# Altium project BQ76930.PrjPcb
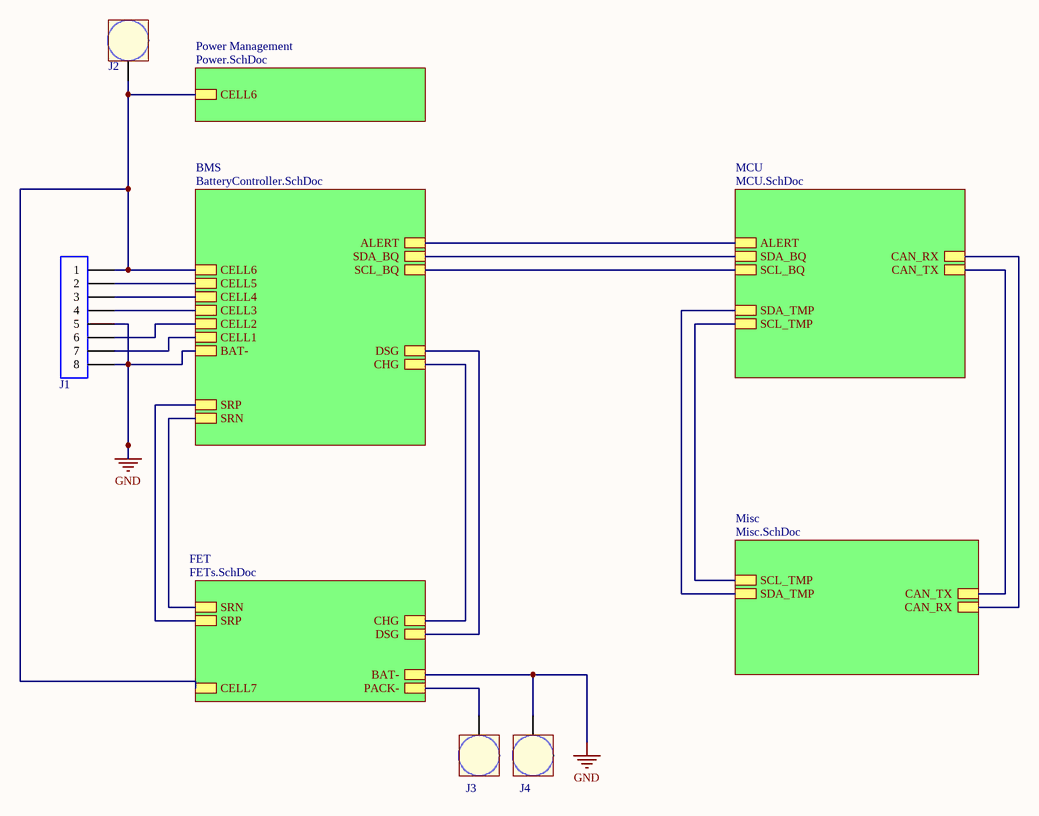
[diagram p0: TopLevel.SchDoc]
6 sheets, 119 parts. Net scope: hierarchical (ports join the sheet entries above them; power ports are global).
Board file: BQ76930.PcbDoc
Sheets:
  TopLevel.SchDoc
    BMS = BatteryController.SchDoc
    MCU = MCU.SchDoc
    FET = FETs.SchDoc
    Misc = Misc.SchDoc
    Power Management = Power.SchDoc

## Sheet TopLevel.SchDoc: TopLevel
size A4; ApprovedBy: Self; CheckedBy: Self; CompanyName: TAISAT; DrawnBy: Alperen FENERCİ; Organization: IKA; SheetNumber: 1; SheetTotal: 6

### Parts
J1  HEADER-MALE-SMT-90C-4COL-2ROW  [0430450810]  (value not drawn)
J2  7460305  [7460305]  (value not drawn)
J3  7460305  [7460305]  (value not drawn)
J4  7460305  [7460305]  (value not drawn)

### Sub-sheets
BMS = BatteryController.SchDoc: CELL1, BAT-, CELL2, CELL3, CELL4, CELL5, CELL6, SCL_BQ, SDA_BQ, CHG, DSG, ALERT, SRN, SRP
FET = FETs.SchDoc: CHG, DSG, PACK-, BAT-, SRN, SRP, CELL7
MCU = MCU.SchDoc: SCL_BQ, SDA_BQ, ALERT, SCL_TMP, SDA_TMP, CAN_RX, CAN_TX
Misc = Misc.SchDoc: CAN_RX, CAN_TX, SCL_TMP, SDA_TMP
Power Management = Power.SchDoc: CELL6

### Nets
GND: J1.5 J1.8 J4.1 ; sheet BMS/BAT-, sheet FET/BAT-
NetC11_1: sheet BMS/ALERT, sheet MCU/ALERT
NetC19_1: sheet BMS/SRP, sheet FET/SRP
NetC20_2: sheet BMS/SRN, sheet FET/SRN
NetC30_1: J1.1 J2.1 ; sheet BMS/CELL6, sheet FET/CELL7, sheet Power Management/CELL6
NetD1_2: J1.3 ; sheet BMS/CELL4
NetD2_2: J1.4 ; sheet BMS/CELL3
NetD3_2: J1.6 ; sheet BMS/CELL2
NetD4_2: J1.7 ; sheet BMS/CELL1
NetD10_2: J1.2 ; sheet BMS/CELL5
NetD18_2: J3.1 ; sheet FET/PACK-
NetQ10_2: sheet BMS/CHG, sheet FET/CHG
NetR29_2: sheet BMS/DSG, sheet FET/DSG
NetR35_1: sheet BMS/SDA_BQ, sheet MCU/SDA_BQ, sheet MCU/SDA_TMP, sheet Misc/SDA_TMP
NetR36_1: sheet BMS/SCL_BQ, sheet MCU/SCL_BQ, sheet MCU/SCL_TMP, sheet Misc/SCL_TMP
NetU2_32: sheet MCU/CAN_RX, sheet Misc/CAN_RX
NetU2_33: sheet MCU/CAN_TX, sheet Misc/CAN_TX

### Notes on the sheet
- Dosya Adı / File Name
- Proje Adı / Project Name
- Sayfa Adı / Sheet Name
- Şirket Adı / Company Name
- Tasarlayan / Designed By
- Takım / Team
- Kontrol Eden / Checked By
- Başlangıç Tarihi / Start Date
- Revize Tarihi / Revision Date
- Onaylayan / Approved By
- Sayfa / Sheet

### Library data of the parts
J1 = 0430450810: Connector; Pin Rows: 2; Pin Positions: 8; Contact Type: Male; ComponentLink1Description: Digikey; ComponentLink1URL: https://www.digikey.com/en/products/detail/molex/0430450810/2404815?s=N4IgTCBcDaIAwBYDMiCscAcBGOIC6AvkA; ComponentLink2Description: Ozdisan; ComponentLink2URL: https://ozdisan.com/connectors-and-interconnects/rectangular-connectors/pcb-connectors/L-KLS1-XM1-3-00-2X04-RT/512932; ComponentLink3Description: Datasheet; ComponentLink3URL: https://www.molex.com/en-us/products/part-detail/430450810?display=pdf; Case/Package: SMD; ComponentLink4Description: Datasheet; ComponentLink4URL: https://cdn.ozdisan.com/ETicaret_Dosya/482201_886496495..pdf
J2-J4 = 7460305: Connector

## Sheet BatteryController.SchDoc: Battery Management
size A3; ApprovedBy: Self; CheckedBy: Self; CompanyName: TAISAT; DrawnBy: Alperen FENERCİ; Organization: IKA; SheetNumber: 2; SheetTotal: 6
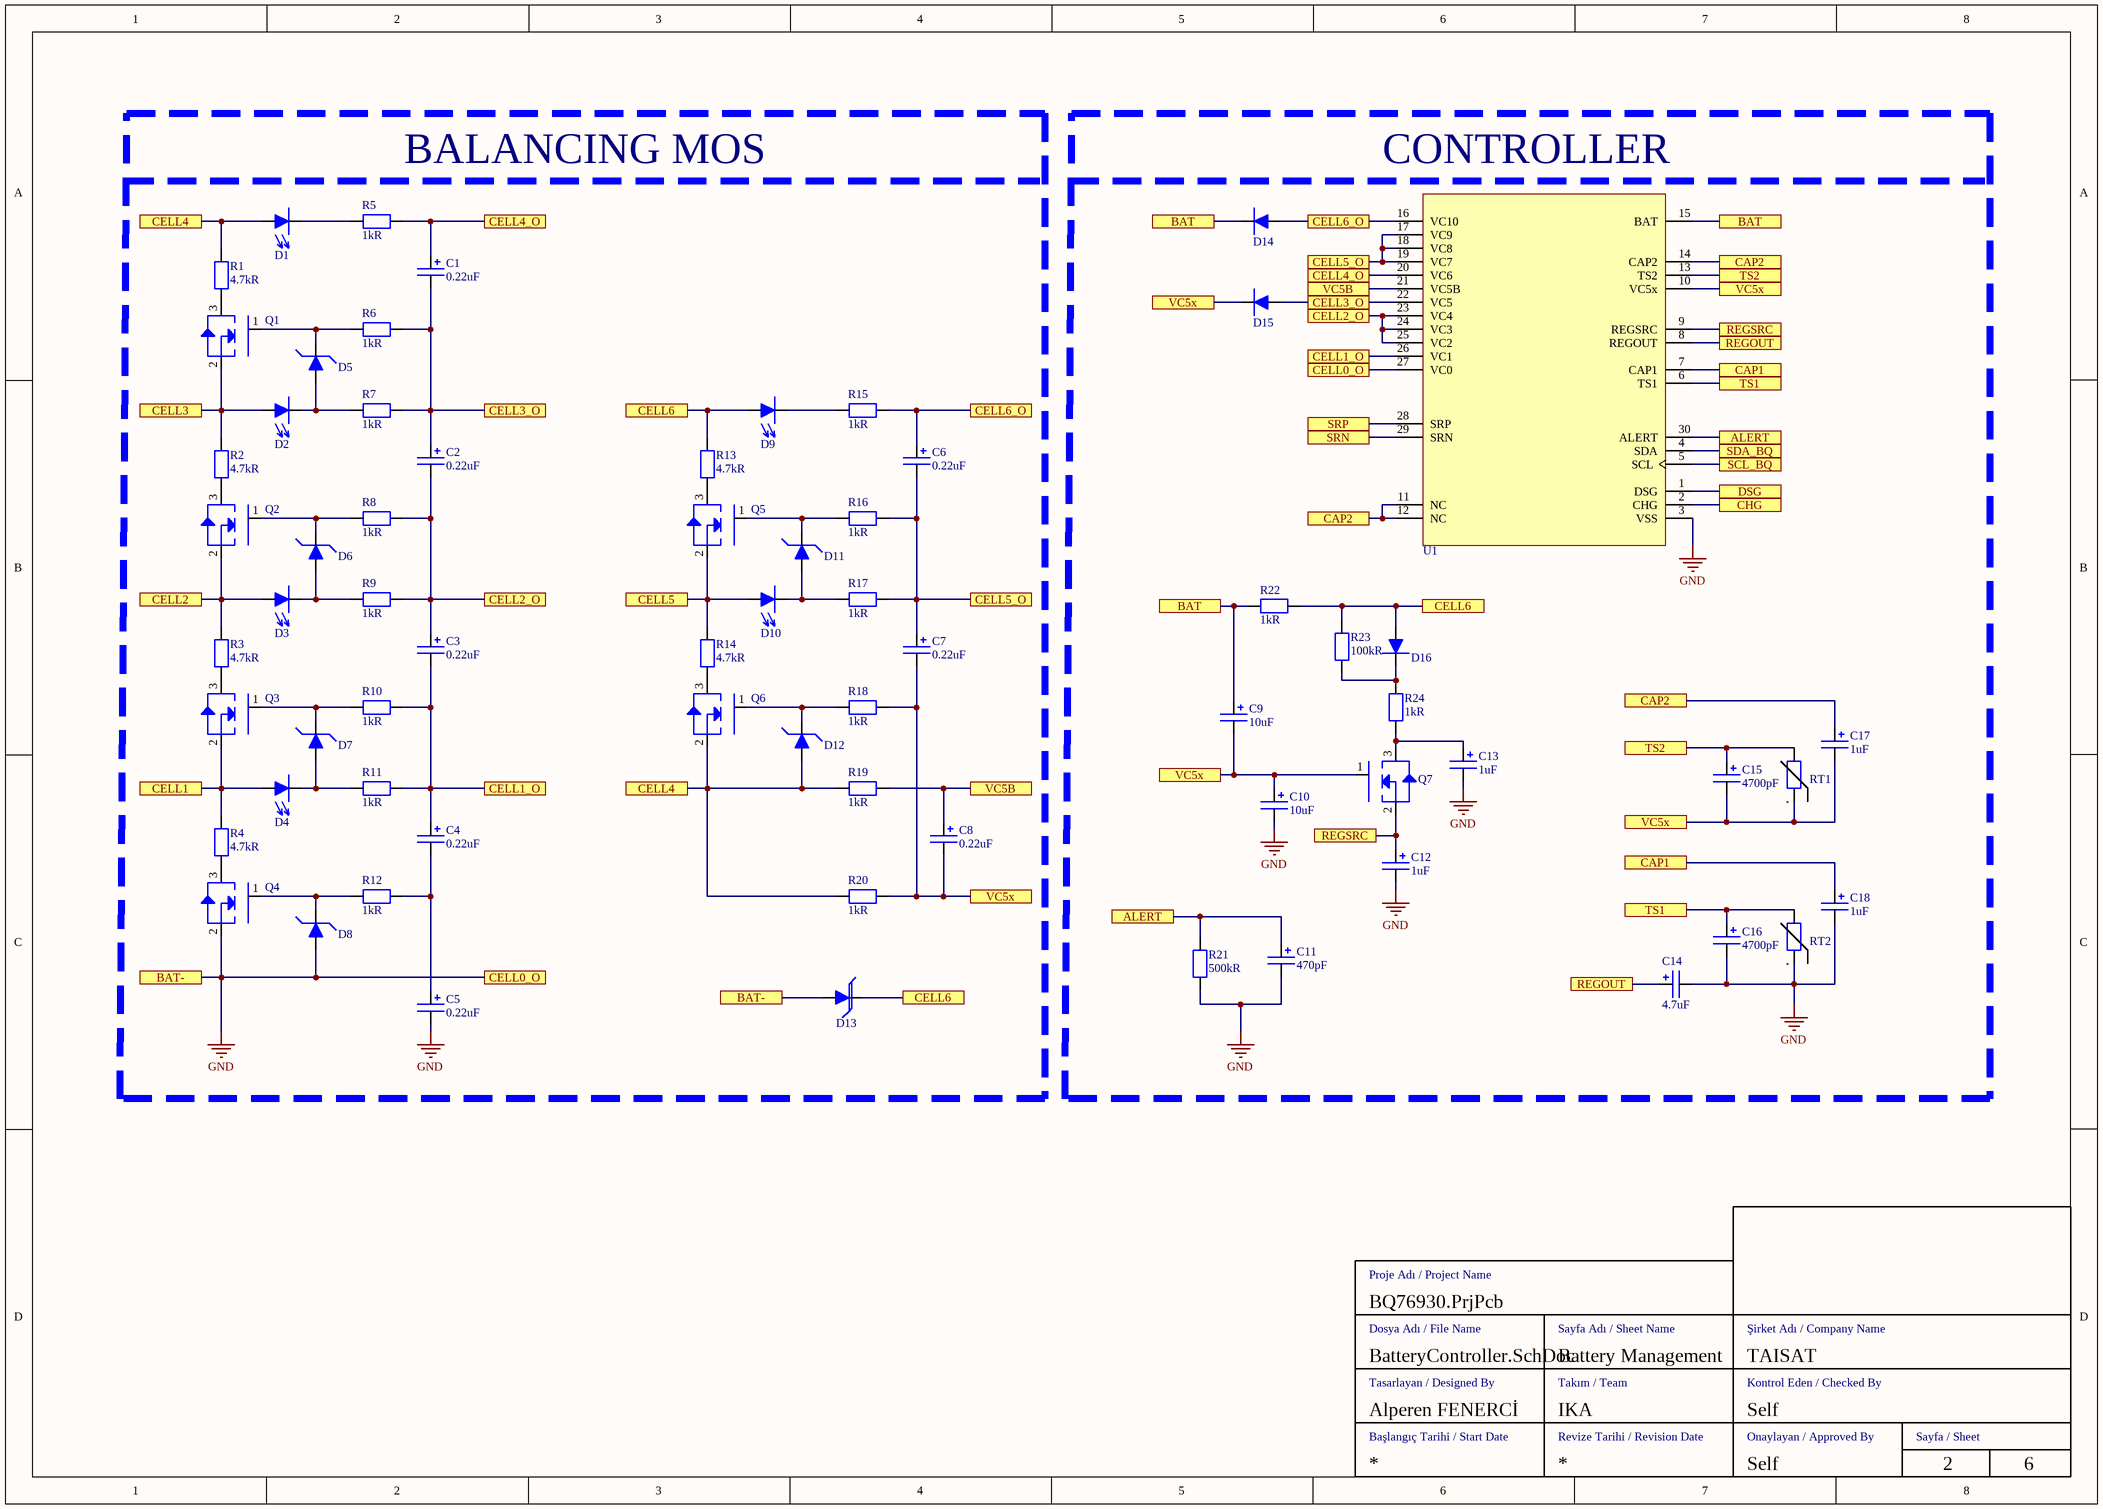
[diagram p1: BatteryController.SchDoc]

### Parts
C1  value 0.22uF  [CAP 0603]  (hidden comment: CAP 0603)
C2  value 0.22uF  [CAP 0603]  (hidden comment: CAP 0603)
C3  value 0.22uF  [CAP 0603]  (hidden comment: CAP 0603)
C4  value 0.22uF  [CAP 0603]  (hidden comment: CAP 0603)
C5  value 0.22uF  [CAP 0603]  (hidden comment: CAP 0603)
C6  value 0.22uF  [CAP 0603]  (hidden comment: CAP 0603)
C7  value 0.22uF  [CAP 0603]  (hidden comment: CAP 0603)
C8  value 0.22uF  [CAP 0603]  (hidden comment: CAP 0603)
C9  value 10uF  [CAP 0603]  (hidden comment: CAP 0603)
C10  value 10uF  [CAP 0603]  (hidden comment: CAP 0603)
C11  value 470pF  [CAP 0603]  (hidden comment: CAP 0603)
C12  value 1uF  [CAP 0603]  (hidden comment: CAP 0603)
C13  value 1uF  [CAP 0603]  (hidden comment: CAP 0603)
C14  value 4.7uF  [CAP 0603]  (hidden comment: CAP 0603)
C15  value 4700pF  [CAP 0603]  (hidden comment: CAP 0603)
C16  value 4700pF  [CAP 0603]  (hidden comment: CAP 0603)
C17  value 1uF  [CAP 0603]  (hidden comment: CAP 0603)
C18  value 1uF  [CAP 0603]  (hidden comment: CAP 0603)
D1  LTW-C191TLA  [LED 0603]  (value not drawn)
D2  LTW-C191TLA  [LED 0603]  (value not drawn)
D3  LTW-C191TLA  [LED 0603]  (value not drawn)
D4  LTW-C191TLA  [LED 0603]  (value not drawn)
D5  MM3Z5V1T1G  [SOD323]  (value not drawn)
D6  MM3Z5V1T1G  [SOD323]  (value not drawn)
D7  MM3Z5V1T1G  [SOD323]  (value not drawn)
D8  MM3Z5V1T1G  [SOD323]  (value not drawn)
D9  LTW-C191TLA  [LED 0603]  (value not drawn)
D10  LTW-C191TLA  [LED 0603]  (value not drawn)
D11  MM3Z5V1T1G  [SOD323]  (value not drawn)
D12  MM3Z5V1T1G  [SOD323]  (value not drawn)
D13  SMAJ36A-HT  [DO214AC]  (value not drawn)
D14  BAV20W-7-F  [SOD123]  (value not drawn)
D15  BAV20W-7-F  [SOD123]  (value not drawn)
D16  1N4148WS  [SOD323]  (value not drawn)
Q1  2N7002K  [SOT23-3]  (value not drawn)
Q2  2N7002K  [SOT23-3]  (value not drawn)
Q3  2N7002K  [SOT23-3]  (value not drawn)
Q4  2N7002K  [SOT23-3]  (value not drawn)
Q5  2N7002K  [SOT23-3]  (value not drawn)
Q6  2N7002K  [SOT23-3]  (value not drawn)
Q7  2N7002K  [SOT23-3]  (value not drawn)
R1  value 4.7kR  [RESISTOR 1206]  (hidden comment: RES 1206)
R2  value 4.7kR  [RESISTOR 1206]  (hidden comment: RES 1206)
R3  value 4.7kR  [RESISTOR 1206]  (hidden comment: RES 1206)
R4  value 4.7kR  [RESISTOR 1206]  (hidden comment: RES 1206)
R5  value 1kR  [RESISTOR 0603]  (hidden comment: RES 0603)
R6  value 1kR  [RESISTOR 0603]  (hidden comment: RES 0603)
R7  value 1kR  [RESISTOR 0603]  (hidden comment: RES 0603)
R8  value 1kR  [RESISTOR 0603]  (hidden comment: RES 0603)
R9  value 1kR  [RESISTOR 0603]  (hidden comment: RES 0603)
R10  value 1kR  [RESISTOR 0603]  (hidden comment: RES 0603)
R11  value 1kR  [RESISTOR 0603]  (hidden comment: RES 0603)
R12  value 1kR  [RESISTOR 0603]  (hidden comment: RES 0603)
R13  value 4.7kR  [RESISTOR 1206]  (hidden comment: RES 1206)
R14  value 4.7kR  [RESISTOR 1206]  (hidden comment: RES 1206)
R15  value 1kR  [RESISTOR 0603]  (hidden comment: RES 0603)
R16  value 1kR  [RESISTOR 0603]  (hidden comment: RES 0603)
R17  value 1kR  [RESISTOR 0603]  (hidden comment: RES 0603)
R18  value 1kR  [RESISTOR 0603]  (hidden comment: RES 0603)
R19  value 1kR  [RESISTOR 0603]  (hidden comment: RES 0603)
R20  value 1kR  [RESISTOR 0603]  (hidden comment: RES 0603)
R21  value 500kR  [RESISTOR 0603]  (hidden comment: RES 0603)
R22  value 1kR  [RESISTOR 0603]  (hidden comment: RES 0603)
R23  value 100kR  [RESISTOR 0603]  (hidden comment: RES 0603)
R24  value 1kR  [RESISTOR 0603]  (hidden comment: RES 0603)
RT1  NTC 0603  [NTC 0603]  (value not drawn)
RT2  NTC 0603  [NTC 0603]  (value not drawn)
U1  BQ76930  [TSSOP-30]  (value not drawn)

### Blocks framed on the sheet
BALANCING MOS: C1-C8 D1-D13 Q1-Q6 R1-R20
CONTROLLER: C9-C18 D14-D16 Q7 R21-R24 RT1 RT2 U1

### Ports
ALERT, BAT, BAT-, CAP1, CAP2, CELL0_O, CELL1, CELL1_O, CELL2, CELL2_O, CELL3, CELL3_O, CELL4, CELL4_O, CELL5, CELL5_O, CELL6, CELL6_O, CHG, DSG, REGOUT, REGSRC, SCL_BQ, SDA_BQ, SRN, SRP, TS1, TS2, VC5B, VC5x

### Nets
GND: C5.2 C10.2 C11.2 C12.2 C13.2 C14.2 C16.2 C18.2 D8.2 D13.2 Q4.2(S) R21.1 RT2.1 U1.3(VSS) U1.27(VC0) ; port BAT-, port CELL0_O
NetC1_1: C1.1 R5.1 U1.20(VC6) ; port CELL4_O
NetC1_2: C1.2 C2.1 D15.2 R6.1 R7.1 U1.22(VC5) ; port CELL3_O
NetC2_2: C2.2 C3.1 R8.1 R9.1 U1.23(VC4) U1.24(VC3) U1.25(VC2) ; port CELL2_O
NetC3_2: C3.2 C4.1 R10.1 R11.1 U1.26(VC1) ; port CELL1_O
NetC4_2: C4.2 C5.1 R12.1
NetC6_1: C6.1 D14.2 R15.1 U1.16(VC10) ; port CELL6_O
NetC6_2: C6.2 C7.1 R16.1 R17.1 U1.17(VC9) U1.18(VC8) U1.19(VC7) ; port CELL5_O
NetC7_2: C7.2 C8.2 C9.2 C10.1 C15.2 C17.2 D15.1 Q7.1(G) R18.1 R20.1 RT1.1 U1.10(VC5x) ; port VC5x
NetC8_1: C8.1 R19.1 U1.21(VC5B) ; port VC5B
NetC9_1: C9.1 D14.1 R22.2 U1.15(BAT) ; port BAT
NetC11_1: C11.1 R21.2 U1.30(ALERT) ; port ALERT
NetC12_1: C12.1 Q7.2(S) U1.9(REGSRC) ; port REGSRC
NetC13_1: C13.1 Q7.3(D) R24.1
NetC14_1: C14.1 U1.8(REGOUT) ; port REGOUT
NetC15_1: C15.1 RT1.2 U1.13(TS2) ; port TS2
NetC16_1: C16.1 RT2.2 U1.6(TS1) ; port TS1
NetC17_1: C17.1 U1.11(NC) U1.12(NC) U1.14(CAP2) ; port CAP2
NetC18_1: C18.1 U1.7(CAP1) ; port CAP1
NetC19_1: U1.28(SRP) ; port SRP
NetC20_2: U1.29(SRN) ; port SRN
NetC30_1: D9.2 D13.1 D16.2 R13.2 R22.1 R23.2 ; port CELL6
NetD1_1: D1.1 R5.2
NetD1_2: D1.2 D12.2 Q6.2(S) R1.2 R19.2 R20.2 ; port CELL4
NetD2_1: D2.1 D5.2 R7.2
NetD2_2: D2.2 Q1.2(S) R2.2 ; port CELL3
NetD3_1: D3.1 D6.2 R9.2
NetD3_2: D3.2 Q2.2(S) R3.2 ; port CELL2
NetD4_1: D4.1 D7.2 R11.2
NetD4_2: D4.2 Q3.2(S) R4.2 ; port CELL1
NetD5_1: D5.1 Q1.1(G) R6.2
NetD6_1: D6.1 Q2.1(G) R8.2
NetD7_1: D7.1 Q3.1(G) R10.2
NetD8_1: D8.1 Q4.1(G) R12.2
NetD9_1: D9.1 R15.2
NetD10_1: D10.1 D11.2 R17.2
NetD10_2: D10.2 Q5.2(S) R14.2 ; port CELL5
NetD11_1: D11.1 Q5.1(G) R16.2
NetD12_1: D12.1 Q6.1(G) R18.2
NetD16_1: D16.1 R23.1 R24.2
NetQ1_3: Q1.3(D) R1.1
NetQ2_3: Q2.3(D) R2.1
NetQ3_3: Q3.3(D) R3.1
NetQ4_3: Q4.3(D) R4.1
NetQ5_3: Q5.3(D) R13.1
NetQ6_3: Q6.3(D) R14.1
NetQ10_2: U1.2(CHG) ; port CHG
NetR29_2: U1.1(DSG) ; port DSG
NetR35_1: U1.4(SDA) ; port SDA_BQ
NetR36_1: U1.5(SCL) ; port SCL_BQ

### Notes on the sheet
- Dosya Adı / File Name
- Proje Adı / Project Name
- Sayfa Adı / Sheet Name
- Şirket Adı / Company Name
- Tasarlayan / Designed By
- Takım / Team
- Kontrol Eden / Checked By
- Başlangıç Tarihi / Start Date
- Revize Tarihi / Revision Date
- Onaylayan / Approved By
- Sayfa / Sheet

### Library data of the parts
C1-C18 = CAP 0603: Multilayer Ceramic Capacitor; Capacitor Type: MLCC; Case/Package: 0603
D1-D4 D9 D10 = LED 0603: Chip LED; Case/Package: 0603
D5-D8 D11 D12 = MM3Z5V1T1G: Diode Zener; Voltage: 5.1V; Case/Package: SOD323; Diode Type: Zener; ComponentLink1Description: Ozdisan; ComponentLink1URL: https://ozdisan.com/power-semiconductors/diodes-diode-modules-and-rectifiers/zener-diodes/MM3Z5V1T1G/611730
D13 = SMAJ36A-HT: Diode TVS; Voltage: 36V; Diode Type: TVS; Case/Package: DO214
D14 D15 = BAV20W-7-F: Diode Switch; Voltage: 150V; Case/Package: SOD123; Diode Type: Switch
D16 = 1N4148WS: Diode Gen; Voltage: 75V; Diode Type: General; Case/Package: DO-41-2; ComponentLink1Description: Ozdisan; ComponentLink1URL: https://ozdisan.com/power-semiconductors/diodes-diode-modules-and-rectifiers/general-purpose-diodes/1N4148WS-HT/453557
Q1-Q7 = 2N7002K: MOSFET; Voltage: 60V; Current: 300mA; Transistor Type: N-CH; Case/Package: SOT23
R1-R4 R13 R14 = RES 1206: SMD Chip Resistor; Case/Package: 1206
R5-R12 R15-R24 = RES 0603: SMD Chip Resistor; Case/Package: 0603
RT1 RT2 = NTC 0603: Thermistor NTC; Value: 10kR; Case/Package: 0603
U1 = BQ76930: Cell Balance, Cell Monitoring; Category: PMIC; Case/Package: TSSOP

## Sheet MCU.SchDoc: Controller
size A4; ApprovedBy: Self; CheckedBy: Self; CompanyName: TAISAT; DrawnBy: Alperen FENERCİ; Organization: IKA; SheetNumber: 4; SheetTotal: 6
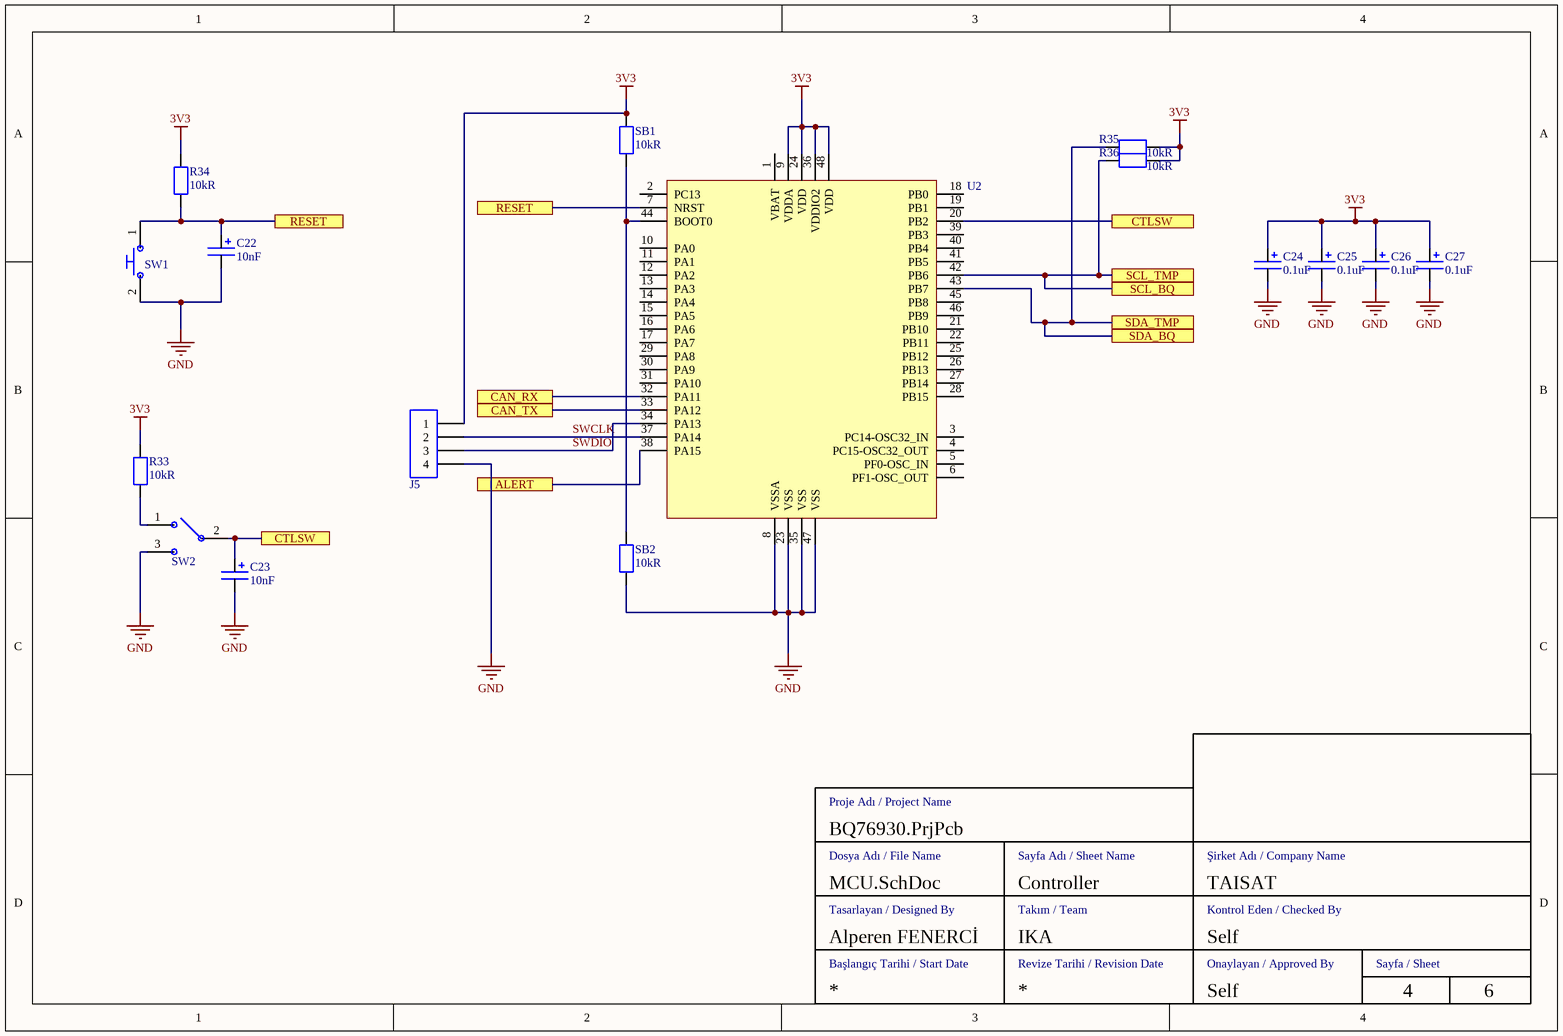
[diagram p2: MCU.SchDoc]

### Parts
C22  value 10nF  [CAP 0603]  (hidden comment: CAP 0603)
C23  value 10nF  [CAP 0603]  (hidden comment: CAP 0603)
C24  value 0.1uF  [CAP 0603]  (hidden comment: CAP 0603)
C25  value 0.1uF  [CAP 0603]  (hidden comment: CAP 0603)
C26  value 0.1uF  [CAP 0603]  (hidden comment: CAP 0603)
C27  value 0.1uF  [CAP 0603]  (hidden comment: CAP 0603)
J5  146285-4  [HMATHT00C41]  (value not drawn)
R33  value 10kR  [RESISTOR 0603]  (hidden comment: RES 0603)
R34  value 10kR  [RESISTOR 0603]  (hidden comment: RES 0603)
R35  value 10kR  [RESISTOR 0603]  (hidden comment: RES 0603)
R36  value 10kR  [RESISTOR 0603]  (hidden comment: RES 0603)
SB1  value 10kR  [RESISTOR 0603]  (hidden comment: RES 0603)
SB2  value 10kR  [RESISTOR 0603]  (hidden comment: RES 0603)
SW1  DS1042-03  [SWITCH-6X6]  (value not drawn)
SW2  L-KLS7-SS-12F20A  [SPDT]  (value not drawn)
U2  STM32F072C8  [LQFP48]  (value not drawn)

### Ports
ALERT, CAN_RX, CAN_TX, CTLSW, RESET, SCL_BQ, SCL_TMP, SDA_BQ, SDA_TMP

### Nets
3V3: C24.1 C25.1 C26.1 C27.1 J5.1 R33.2 R34.2 R35.2 R36.2 SB1.2 U2.9(VDDA) U2.24(VDD) U2.36(VDDIO2) U2.48(VDD)
GND: C22.2 C23.2 C24.2 C25.2 C26.2 C27.2 J5.4 SB2.1 SW1.2 SW2.3 U2.8(VSSA) U2.23(VSS) U2.35(VSS) U2.47(VSS)
SWCLK: J5.2 U2.37(PA14)
SWDIO: J5.3 U2.34(PA13)
NetC11_1: U2.38(PA15) ; port ALERT
NetC22_1: C22.1 R34.1 SW1.1 U2.7(NRST) ; port RESET
NetC23_1: C23.1 SW2.2 U2.20(PB2) ; port CTLSW
NetR33_1: R33.1 SW2.1
NetR35_1: R35.1 U2.43(PB7) ; port SDA_BQ, port SDA_TMP
NetR36_1: R36.1 U2.42(PB6) ; port SCL_BQ, port SCL_TMP
NetSB1_1: SB1.1 SB2.2 U2.44(BOOT0)
NetU2_32: U2.32(PA11) ; port CAN_RX
NetU2_33: U2.33(PA12) ; port CAN_TX

Not connected (* = marked no-connect by the designer): U2 1(VBAT) 2(PC13) 3(PC14-OSC32_IN) 4(PC15-OSC32_OUT) 5(PF0-OSC_IN) 6(PF1-OSC_OUT) 10(PA0) 11(PA1) 12(PA2) 13(PA3) 14(PA4) 15(PA5) 16(PA6) 17(PA7) 18(PB0) 19(PB1) 21(PB10) 22(PB11) 25(PB12) 26(PB13) 27(PB14) 28(PB15) 29(PA8) 30(PA9) 31(PA10) 39(PB3) 40(PB4) 41(PB5) 45(PB8) 46(PB9)

### Notes on the sheet
- Dosya Adı / File Name
- Proje Adı / Project Name
- Sayfa Adı / Sheet Name
- Şirket Adı / Company Name
- Tasarlayan / Designed By
- Takım / Team
- Kontrol Eden / Checked By
- Başlangıç Tarihi / Start Date
- Revize Tarihi / Revision Date
- Onaylayan / Approved By
- Sayfa / Sheet

### Library data of the parts
C22-C27 = CAP 0603: as C1 on sheet BatteryController; Case/Package: 0603
J5 = HMATHT00C41: Header for PCB
R33-R36 SB1 SB2 = RES 0603: SMD Chip Resistor; Case/Package: 0603
SW1 = DS1042-03: Switch
SW2 = L-KLS7-SS-12F20A: Switch
U2 = STM32F072C8: STM32 ARM Cortex M0; Case/Package: LQFP; Pins: 48; Category: MCU

## Sheet FETs.SchDoc: FET System
size A4; ApprovedBy: Self; CheckedBy: Self; CompanyName: TAISAT; DrawnBy: Alperen FENERCİ; Organization: IKA; SheetNumber: 3; SheetTotal: 6
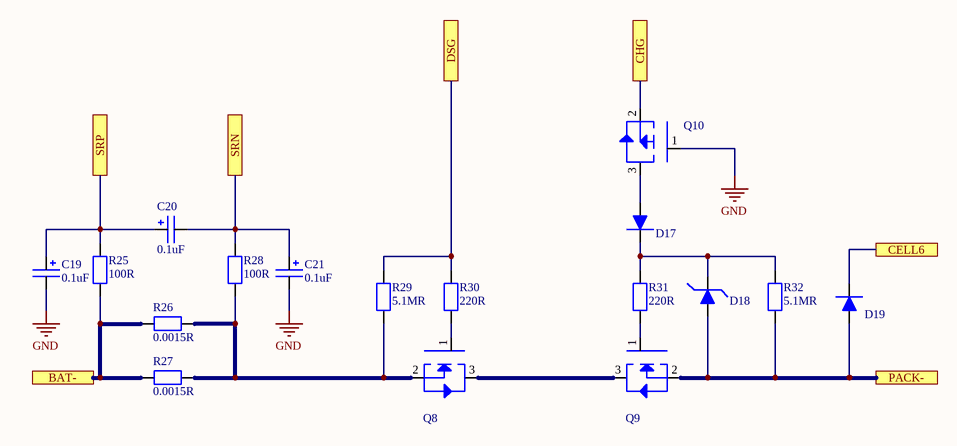
[diagram p3: FETs.SchDoc]

### Parts
C19  value 0.1uF  [CAP 0603]  (hidden comment: CAP 0603)
C20  value 0.1uF  [CAP 0603]  (hidden comment: CAP 0603)
C21  value 0.1uF  [CAP 0603]  (hidden comment: CAP 0603)
D17  1N4007W  [SOD123]  (value not drawn)
D18  MMSZ36V-HT  [SOD123]  (value not drawn)
D19  US1D_R1  [DO214AC]  (value not drawn)
Q8  IRF2804STRL  [D2PAK-7]  (value not drawn)
Q9  IRF2804STRL  [D2PAK-7]  (value not drawn)
Q10  PJA3441  [SOT23-3]  (value not drawn)
R25  value 100R  [RESISTOR 0603]  (hidden comment: RES 0603)
R26  value 0.0015R  [RESISTOR 2512]  (hidden comment: RES 2512)
R27  value 0.0015R  [RESISTOR 2512]  (hidden comment: RES 2512)
R28  value 100R  [RESISTOR 0603]  (hidden comment: RES 0603)
R29  value 5.1MR  [RESISTOR 0603]  (hidden comment: RES 0603)
R30  value 220R  [RESISTOR 0603]  (hidden comment: RES 0603)
R31  value 220R  [RESISTOR 0603]  (hidden comment: RES 0603)
R32  value 5.1MR  [RESISTOR 0603]  (hidden comment: RES 0603)

### Ports
BAT-, CELL6, CHG, DSG, PACK-, SRN, SRP

### Nets
GND: C19.2 C21.2 Q10.1(G) R25.1 R26.1 R27.1 ; port BAT-
NetC19_1: C19.1 C20.1 R25.2 ; port SRP
NetC20_2: C20.2 C21.1 R28.2 ; port SRN
NetD17_1: D17.1 D18.1 R31.2 R32.2
NetD17_2: D17.2 Q10.3(D)
NetD18_2: D18.2 D19.2 Q9.2(S) R32.1 ; port PACK-
NetD19_1: D19.1 ; port CELL6
NetQ8_1: Q8.1(G) R30.1
NetQ8_2: Q8.2(S) R26.2 R27.2 R28.1 R29.1
NetQ8_3: Q8.3(D) Q9.3(D)
NetQ9_1: Q9.1(G) R31.1
NetQ10_2: Q10.2(S) ; port CHG
NetR29_2: R29.2 R30.2 ; port DSG

### Notes on the sheet
- Dosya Adı / File Name
- Proje Adı / Project Name
- Sayfa Adı / Sheet Name
- Şirket Adı / Company Name
- Tasarlayan / Designed By
- Takım / Team
- Kontrol Eden / Checked By
- Başlangıç Tarihi / Start Date
- Revize Tarihi / Revision Date
- Onaylayan / Approved By
- Sayfa / Sheet

### Library data of the parts
C19-C21 = CAP 0603: as C1 on sheet BatteryController; Case/Package: 0603
D17 = 1N4007W: Diode Gen; Voltage: 1000V; Diode Type: General; Case/Package: DO-41-2
D18 = MMSZ36V-HT: Diode Zener; Voltage: 36V; Case/Package: SOD123; Diode Type: Zener
D19 = US1D_R1: Diode Gen; Voltage: 200V; Diode Type: General; Case/Package: DO-214AC
Q8 Q9 = IRF2804STRL: MOSFET; Voltage: 40V; Current: 160A; Transistor Type: N-CH; Case/Package: TO263-7
Q10 = PJA3441: MOSFET; Transistor Type: P-CH; Voltage: 40V; Current: 3.1A; Case/Package: SOT23
R25 R28-R32 = RES 0603: SMD Chip Resistor; Case/Package: 0603
R26 R27 = RES 2512: SMD Chip Resistor; Case/Package: 1206

## Sheet Misc.SchDoc: Misc
size A4; ApprovedBy: Self; CheckedBy: Self; CompanyName: TAISAT; DrawnBy: Alperen FENERCİ; Organization: IKA; SheetNumber: 5; SheetTotal: 6
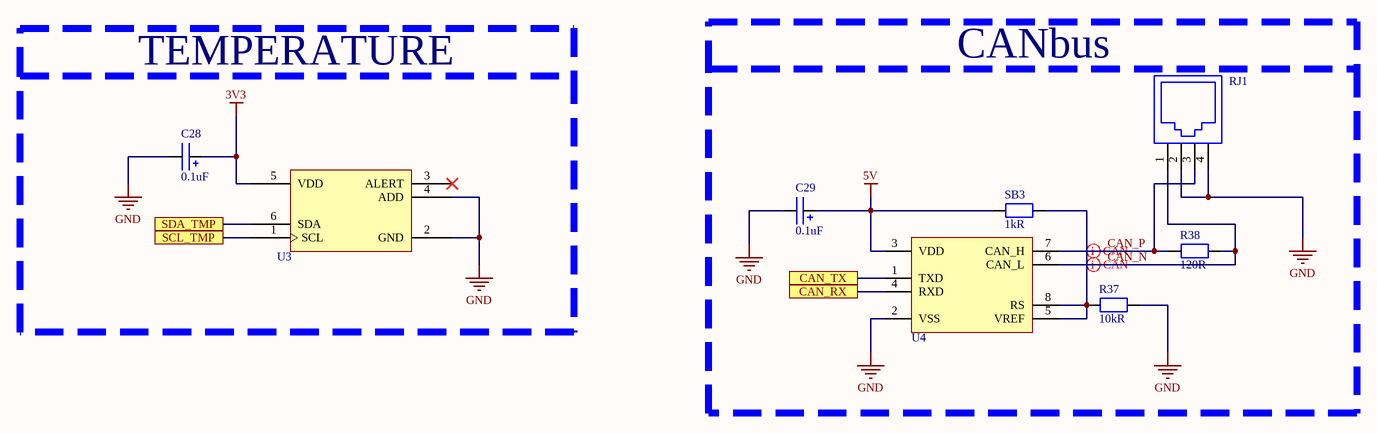
[diagram p4: Misc.SchDoc]

### Parts
C28  value 0.1uF  [CAP 0603]  (hidden comment: CAP 0603)
C29  value 0.1uF  [CAP 0603]  (hidden comment: CAP 0603)
R37  value 10kR  [RESISTOR 0603]  (hidden comment: RES 0603)
R38  value 120R  [RESISTOR 0603]  (hidden comment: RES 0603)
RJ1  DS1133-03-S60BX  [RJ6P4C]  (value not drawn)
SB3  value 1kR  [RESISTOR 0603]  (hidden comment: RES 0603)
U3  TMP112AIDRLT  [SOT563]  (value not drawn)
U4  MCP2551T-I  [SOIC-8]  (value not drawn)

### Blocks framed on the sheet
TEMPERATURE: C28 U3
CANbus: C29 R37 R38 RJ1 SB3 U4

### Ports
CAN_RX, CAN_TX, SCL_TMP, SDA_TMP

### Nets
3V3: C28.1 U3.5(VDD)
5V: C29.1 SB3.2 U4.3(VDD)
GND: C28.2 C29.2 R37.1 RJ1.2 RJ1.4 U3.2(GND) U3.4(ADD) U4.2(VSS)
CAN_N: R38.2 RJ1.1 U4.6(CAN_L)
CAN_P: R38.1 RJ1.3 U4.7(CAN_H)
NetR35_1: U3.6(SDA) ; port SDA_TMP
NetR36_1: U3.1(SCL) ; port SCL_TMP
NetR37_2: R37.2 SB3.1 U4.5(VREF) U4.8(RS)
NetU2_32: U4.4(RXD) ; port CAN_RX
NetU2_33: U4.1(TXD) ; port CAN_TX

Not connected (* = marked no-connect by the designer): U3 3(ALERT)*

### Layout directives
differential pair: CAN_N, CAN_P

### Notes on the sheet
- Dosya Adı / File Name
- Proje Adı / Project Name
- Sayfa Adı / Sheet Name
- Şirket Adı / Company Name
- Tasarlayan / Designed By
- Takım / Team
- Kontrol Eden / Checked By
- Başlangıç Tarihi / Start Date
- Revize Tarihi / Revision Date
- Onaylayan / Approved By
- Sayfa / Sheet

### Library data of the parts
C28 C29 = CAP 0603: as C1 on sheet BatteryController; Case/Package: 0603
R37 R38 SB3 = RES 0603: SMD Chip Resistor; Case/Package: 0603
RJ1 = RJ11: RJ11 Jack; Positions/Contacts: 6P/4C; RJ Type: RJ11
U3 = TMP112AIDRLT: Temp Sensor; Category: Sensor; Package/Case: SOT563
U4 = MCP2551T-I: CAN Transceiver; Category: Interface IC; Case/Package: SOIC-8

## Sheet Power.SchDoc: Power System
size A4; ApprovedBy: Self; CheckedBy: Self; CompanyName: TAISAT; DrawnBy: Alperen FENERCİ; Organization: IKA; SheetNumber: 6; SheetTotal: 6
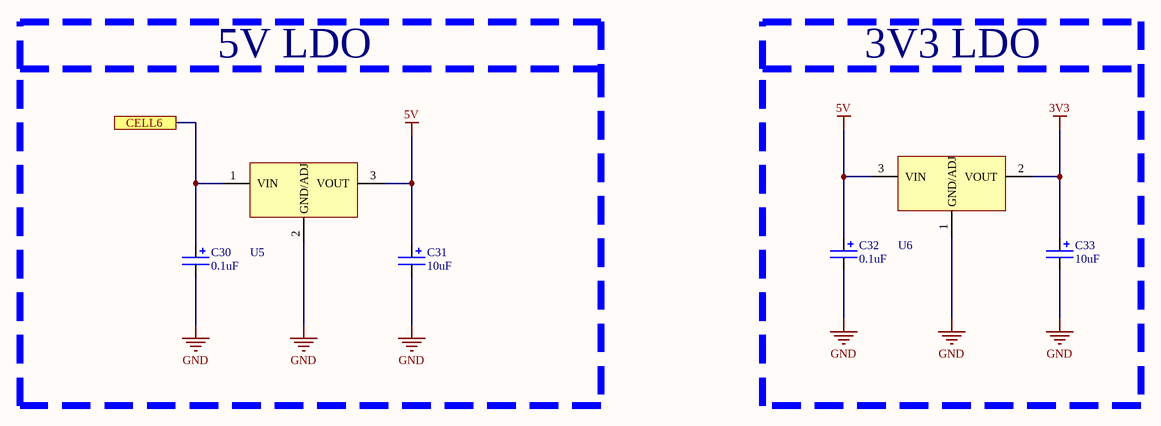
[diagram p5: Power.SchDoc]

### Parts
C30  value 0.1uF  [CAP 0603]  (hidden comment: CAP 0603)
C31  value 10uF  [CAP 0603]  (hidden comment: CAP 0603)
C32  value 0.1uF  [CAP 0603]  (hidden comment: CAP 0603)
C33  value 10uF  [CAP 0603]  (hidden comment: CAP 0603)
U5  LM7805MPX  [SOT223-3]  (value not drawn)
U6  LD1117AS33  [SOT223-3]  (value not drawn)

### Blocks framed on the sheet
5V LDO: C30 C31 U5
3V3 LDO: C32 C33 U6

### Ports
CELL6

### Nets
3V3: C33.1 U6.2(VOUT)
5V: C31.1 C32.1 U5.3(VOUT) U6.3(VIN)
GND: C30.2 C31.2 C32.2 C33.2 U5.2(GND/ADJ) U6.1(GND/ADJ)
NetC30_1: C30.1 U5.1(VIN) ; port CELL6

### Notes on the sheet
- Dosya Adı / File Name
- Proje Adı / Project Name
- Sayfa Adı / Sheet Name
- Şirket Adı / Company Name
- Tasarlayan / Designed By
- Takım / Team
- Kontrol Eden / Checked By
- Başlangıç Tarihi / Start Date
- Revize Tarihi / Revision Date
- Onaylayan / Approved By
- Sayfa / Sheet

### Library data of the parts
C30-C33 = CAP 0603: as C1 on sheet BatteryController; Case/Package: 0603
U5 = LM7805MPX: Regulator Linear
U6 = LD1117AS33: Regulator Linear; Case/Package: SOT223; ComponentLink1Description: Ozdisan; ComponentLink1URL: *; ComponentLink2Description: Datasheet; ComponentLink2URL: *; Category: Linear Regulator

## Nets that join several sheets
3V3: MCU (14 pins), Misc (C28.1 U3.5), Power (C33.1 U6.2)
5V: Misc (C29.1 SB3.2 U4.3), Power (C31.1 C32.1 U5.3 U6.3)
GND: TopLevel (J1.5 J1.8 J4.1), BatteryController (15 pins), MCU (14 pins), FETs (6 pins), Misc (8 pins), Power (6 pins)
NetC11_1: BatteryController (C11.1 R21.2 U1.30), MCU (U2.38)
NetC19_1: BatteryController (U1.28), FETs (C19.1 C20.1 R25.2)
NetC20_2: BatteryController (U1.29), FETs (C20.2 C21.1 R28.2)
NetC30_1: TopLevel (J1.1 J2.1), BatteryController (6 pins), Power (C30.1 U5.1)
NetD1_2: TopLevel (J1.3), BatteryController (6 pins)
NetD2_2: TopLevel (J1.4), BatteryController (D2.2 Q1.2 R2.2)
NetD3_2: TopLevel (J1.6), BatteryController (D3.2 Q2.2 R3.2)
NetD4_2: TopLevel (J1.7), BatteryController (D4.2 Q3.2 R4.2)
NetD10_2: TopLevel (J1.2), BatteryController (D10.2 Q5.2 R14.2)
NetD18_2: TopLevel (J3.1), FETs (D18.2 D19.2 Q9.2 R32.1)
NetQ10_2: BatteryController (U1.2), FETs (Q10.2)
NetR29_2: BatteryController (U1.1), FETs (R29.2 R30.2)
NetR35_1: BatteryController (U1.4), MCU (R35.1 U2.43), Misc (U3.6)
NetR36_1: BatteryController (U1.5), MCU (R36.1 U2.42), Misc (U3.1)
NetU2_32: MCU (U2.32), Misc (U4.4)
NetU2_33: MCU (U2.33), Misc (U4.1)